# EAGLE schematic ATtiny85 Contact Sensor (EAGLE 7.4.0)
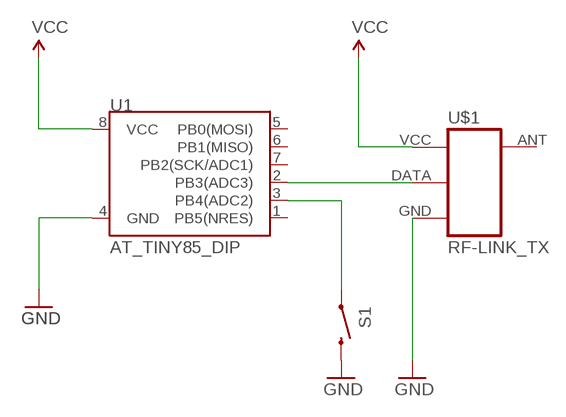
[diagram p0: schematic, sheet 1]

## Parts
S1  SWITCH-MOMENTARY-2PTH  [TACTILE-PTH]
U1  AT_TINY85_DIP  ATTINY45TINY45-20-DIP  [DIP08]
U$1  RF-LINK_TX  [RF-LINK_TX]

## Nets
GND: S1.3 U1.4(GND) U$1.GND
N$1: U1.2(PB3(ADC3)) U$1.DATA
N$2: S1.1 U1.3(PB4(ADC2))
VCC: U1.8(VCC) U$1.VCC(+5V)
Unconnected: U1.1(PB5(NRES)) U1.5(PB0(MOSI)) U1.6(PB1(MISO)) U1.7(PB2(SCK/ADC1)) U$1.ANT

## Library data of the parts
S1 = SparkFun-Electromechanical:SWITCH-MOMENTARY-2: Various NO switches- pushbuttons, reed, etc
U1 = SparkFun-DigitalIC:ATTINY45: Atmel 8-pin 2/4/8kB flash uC; PROD_ID: IC-09439; VALUE: TINY45-20-DIP
U$1 = SparkFun-RF:RF-LINK_TX: RF Link transmitters WRL-8945, 8946